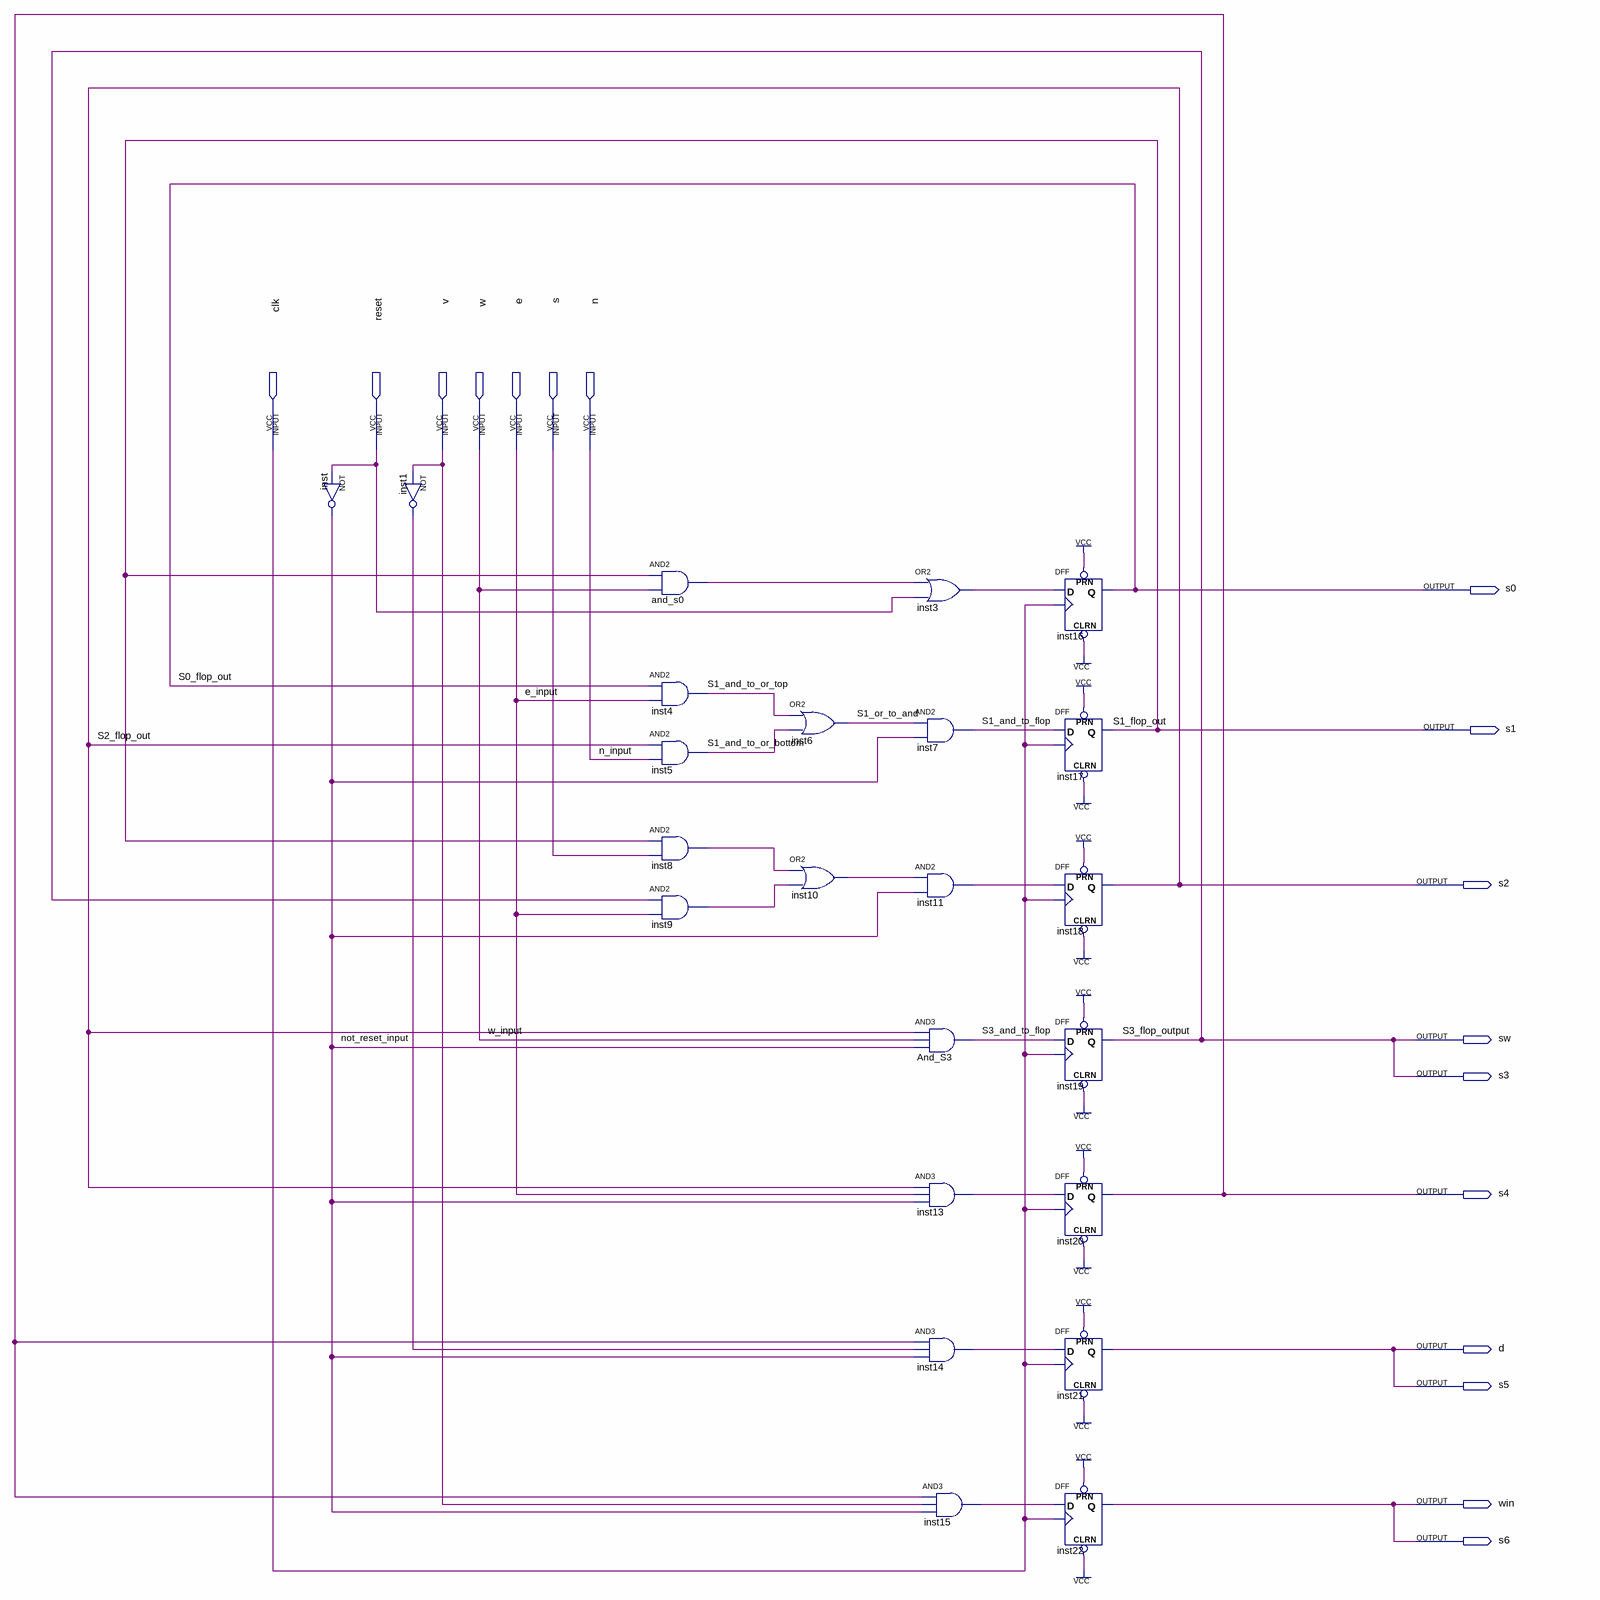
[diagram p0: schematic sheet]
// Quartus schematic room.bdf as structural Verilog: 23 symbols, 17 pins
module room (
  input  clk,
  input  reset,
  input  v,
  input  w,
  input  e,
  input  s,
  input  n,
  output s0,
  output s1,
  output s2,
  output sw,
  output s3,
  output s4,
  output d,
  output s5,
  output win,
  output s6
);

  wire and_s0_out, inst1_out, inst3_out, inst8_out, inst9_out, inst10_out, inst11_out, inst13_out,
       inst14_out, inst15_out, not_reset_input, S1_and_to_flop, S1_and_to_or_bottom, S1_and_to_or_top,
       S1_or_to_and, S3_and_to_flop;

  not inst (not_reset_input, reset);
  not inst1 (inst1_out, v);
  and and_s0 (and_s0_out, s1, w);
  and inst4 (S1_and_to_or_top, s0, e);
  and inst5 (S1_and_to_or_bottom, s2, n);
  and inst8 (inst8_out, s1, s);
  and inst9 (inst9_out, s3, e);
  or inst6 (S1_or_to_and, S1_and_to_or_top, S1_and_to_or_bottom);
  or inst10 (inst10_out, inst8_out, inst9_out);
  or inst3 (inst3_out, and_s0_out, reset);
  and inst7 (S1_and_to_flop, S1_or_to_and, not_reset_input);
  and inst11 (inst11_out, inst10_out, not_reset_input);
  and And_S3 (S3_and_to_flop, s2, w, not_reset_input);
  and inst13 (inst13_out, s2, e, not_reset_input);
  and inst14 (inst14_out, s4, inst1_out, not_reset_input);
  and inst15 (inst15_out, s4, v, not_reset_input);
  DFF inst16 (.CLRN(1'b1), .CLK(clk), .D(inst3_out), .PRN(1'b1), .Q(s0));
  DFF inst17 (.CLRN(1'b1), .CLK(clk), .D(S1_and_to_flop), .PRN(1'b1), .Q(s1));
  DFF inst18 (.CLRN(1'b1), .CLK(clk), .D(inst11_out), .PRN(1'b1), .Q(s2));
  DFF inst19 (.CLRN(1'b1), .CLK(clk), .D(S3_and_to_flop), .PRN(1'b1), .Q(s3));
  DFF inst20 (.CLRN(1'b1), .CLK(clk), .D(inst13_out), .PRN(1'b1), .Q(s4));
  DFF inst21 (.CLRN(1'b1), .CLK(clk), .D(inst14_out), .PRN(1'b1), .Q(d));
  DFF inst22 (.CLRN(1'b1), .CLK(clk), .D(inst15_out), .PRN(1'b1), .Q(s6));

  assign s5 = d;
  assign sw = s3;
  assign win = s6;

  // Other names for the same wires on the sheet: e_input = e; n_input = n; S0_flop_out = s0; S1_flop_out = s1;
  //   S2_flop_out = s2; S3_flop_output = s3; w_input = w
endmodule
